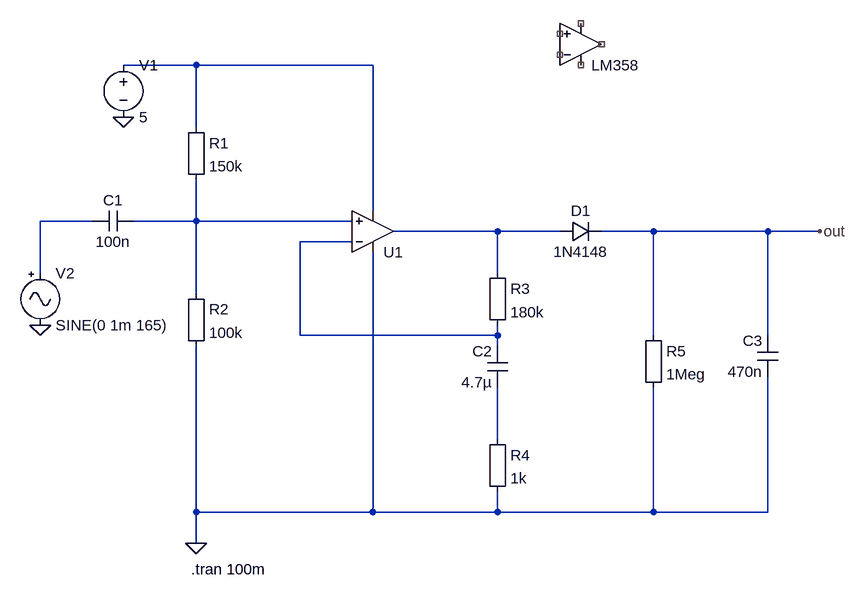
[diagram p0: schematic wzmacniacz.asc]
wzmacniacz.asc, the LTspice schematic file:
Version 4.1
SHEET 1 1128 696
WIRE 112 -96 0 -96
WIRE 384 -96 112 -96
WIRE 112 0 112 -96
WIRE 384 128 384 -96
WIRE -48 144 -128 144
WIRE 112 144 112 80
WIRE 112 144 16 144
WIRE 352 144 112 144
WIRE 576 160 416 160
WIRE 672 160 576 160
WIRE 816 160 736 160
WIRE 992 160 816 160
WIRE 1072 160 992 160
WIRE 352 176 272 176
WIRE -128 224 -128 144
WIRE 576 224 576 160
WIRE 112 256 112 144
WIRE 272 320 272 176
WIRE 576 320 576 304
WIRE 576 320 272 320
WIRE 816 320 816 160
WIRE 992 320 992 160
WIRE 576 336 576 320
WIRE 576 480 576 400
WIRE 112 592 112 336
WIRE 384 592 384 192
WIRE 384 592 112 592
WIRE 576 592 576 560
WIRE 576 592 384 592
WIRE 816 592 816 400
WIRE 816 592 576 592
WIRE 992 592 992 384
WIRE 992 592 816 592
WIRE 112 640 112 592
FLAG 112 640 0
FLAG 0 -16 0
FLAG 1072 160 out
FLAG -128 304 0
SYMBOL cap 16 128 R90
WINDOW 0 0 32 VBottom 2
WINDOW 3 32 32 VTop 2
SYMATTR InstName C1
SYMATTR Value 100n
SYMBOL cap 592 400 R180
WINDOW 0 24 56 Left 2
WINDOW 3 24 8 Left 2
SYMATTR InstName C2
SYMATTR Value 4.7µ
SYMBOL cap 1008 384 R180
WINDOW 0 24 56 Left 2
WINDOW 3 24 8 Left 2
SYMATTR InstName C3
SYMATTR Value 470n
SYMBOL diode 672 176 R270
WINDOW 0 32 32 VTop 2
WINDOW 3 0 32 VBottom 2
SYMATTR InstName D1
SYMATTR Value 1N4148
SYMBOL Misc\\EuropeanResistor 96 -16 R0
SYMATTR InstName R1
SYMATTR Value 150k
SYMBOL Misc\\EuropeanResistor 96 240 R0
SYMATTR InstName R2
SYMATTR Value 100k
SYMBOL Misc\\EuropeanResistor 560 208 R0
SYMATTR InstName R3
SYMATTR Value 180k
SYMBOL Misc\\EuropeanResistor 560 464 R0
SYMATTR InstName R4
SYMATTR Value 1k
SYMBOL Misc\\EuropeanResistor 800 304 R0
SYMATTR InstName R5
SYMATTR Value 1Meg
SYMBOL OpAmps\\UniversalOpAmp2 704 -128 M180
SYMATTR InstName LM358
SYMATTR Value2 Avol=100k GBW=1meg Slew=0.5meg
SYMATTR SpiceLine Ilimit=20m Rail=0 Vos=3m
SYMBOL voltage 0 -112 R0
WINDOW 123 0 0 Left 0
WINDOW 39 0 0 Left 0
SYMATTR InstName V1
SYMATTR Value 5
SYMBOL Misc\\signal -128 208 R0
WINDOW 123 0 0 Left 0
WINDOW 39 0 0 Left 0
SYMATTR InstName V2
SYMATTR Value SINE(0 1m 165)
SYMBOL OpAmps\\UniversalOpAmp2 384 160 M180
SYMATTR InstName U1
TEXT 104 680 Left 2 !.tran 100m

The netlist it stands for:
* wzmacniacz.asc
C1 N003 N002 100n
C2 N006 N005 4.7µ
C3 0 out 470n
D1 N004 out 1N4148
R1 N001 N003 150k
R2 N003 0 100k
R3 N004 N005 180k
R4 N006 0 1k
R5 out 0 1Meg
X§LM358 NC_01 NC_02 NC_03 NC_04 NC_05 level2 Avol=100k GBW=1meg Slew=0.5meg Ilimit=20m Rail=0 Vos=3m En=0 Enk=0 In=0 Ink=0 Rin=500Meg  ; pins In+ In- V+ V- OUT
V1 N001 0 5
V2 N002 0 SINE(0 1m 165)
X§U1 N003 N005 0 N001 N004 level2 Avol=1Meg GBW=10Meg Slew=10Meg Ilimit=25m Rail=0 Vos=0 En=0 Enk=0 In=0 Ink=0 Rin=500Meg  ; pins In+ In- V+ V- OUT
.model D D
.lib standard.dio
.tran 100m
.lib UniversalOpAmp2.lib
.backanno
.end